# EAGLE design brobot (EAGLE 6.6.0)
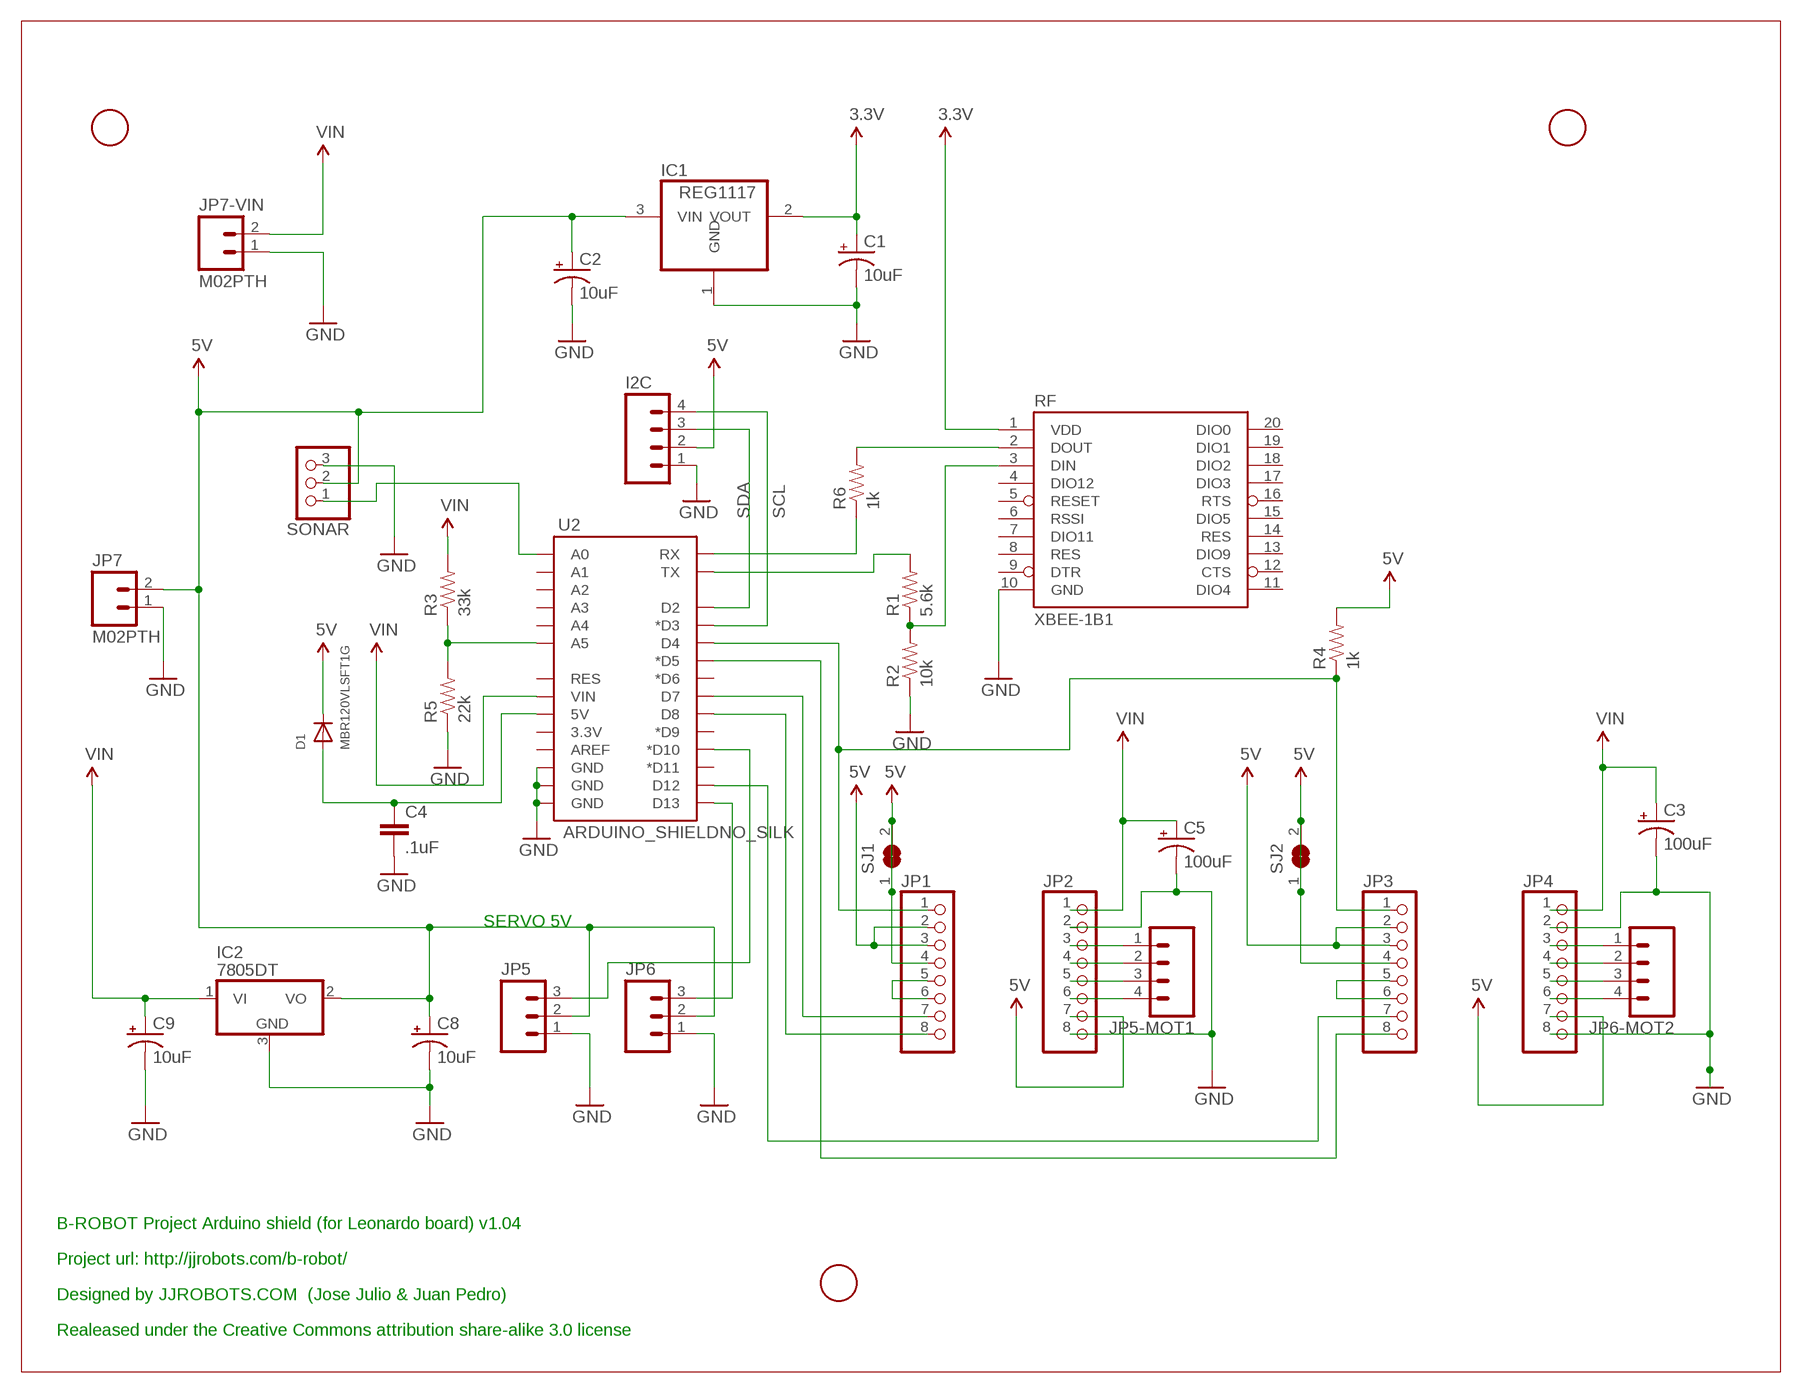
[diagram p0: schematic, sheet 1]

## Parts
C1  10uF  CAP_POL1206  [EIA3216]
C2  10uF  CAP_POL1206  [EIA3216]
C3  100uF  CAP_POLD  [PANASONIC_D]
C4  .1uF  CAP0402-CAP  [0402-CAP]
C5  100uF  CAP_POLD  [PANASONIC_D]
C8  10uF  CAP_POL1206  [EIA3216]
C9  10uF  CAP_POL1206  [EIA3216]
D1  MBR120VLSFT1G  DIODESOD-123  [SOD-123]
I2C  M04PTH  [1X04]
IC1  REG1117  [SOT223]
IC2  7805DT  [TO252]
JP1  PINHD-1X8  [1X08]
JP2  PINHD-1X8  [1X08]
JP3  PINHD-1X8  [1X08]
JP4  PINHD-1X8  [1X08]
JP5  M03PTH  [1X03]
JP5-MOT1  M04PTH  [1X04]
JP6  M03PTH  [1X03]
JP6-MOT2  M04PTH  [1X04]
JP7  M02PTH  [1X02]
JP7-VIN  M02PTH  [1X02]
R1  5.6k  RESISTOR0805-RES  [0805]
R2  10k  RESISTOR0805-RES  [0805]
R3  33k  RESISTOR0805-RES  [0805]
R4  1k  RESISTOR0805-RES  [0805]
R5  22k  RESISTOR0805-RES  [0805]
R6  1k  RESISTOR0805-RES  [0805]
RF  XBEE-1B1  [XBEE-1]
SJ1  SJW  [SJW]
SJ2  SJW  [SJW]
SONAR  PINHD-1X3  [1X03]
U2  ARDUINO_SHIELDNO_SILK  [DUEMILANOVE_VIAS]
U$1  FIDUCIAL  [FIDUCIAL_1MM]
U$2  FIDUCIAL  [FIDUCIAL_1MM]
U$3  FIDUCIAL  [FIDUCIAL_1MM]

## Nets
3.3V: C1.A(+) IC1.2(VOUT) RF.1(VDD)
5V: C2.A(+) C8.A(+) D1.C I2C.2 IC1.3(VIN) IC2.2(VO) JP1.2 JP1.3 JP1.4 JP2.7 JP3.2 JP3.3 JP3.4 JP4.7 JP5.2 JP6.2 JP7.2 R4.2 SJ1.1 SJ1.2 SJ2.1 SJ2.2 SONAR.2
GND: C1.C(-) C2.C(-) C3.- C4.2 C5.- C8.C(-) C9.C(-) I2C.1 IC1.1(GND) IC2.3(GND) JP2.2 JP2.8 JP4.2 JP4.8 JP5.1 JP6.1 JP7-VIN.1 JP7.1 R2.1 R5.1 RF.10(GND) SONAR.3 U2.GND@0(GND) U2.GND@1(GND) U2.GND@2(GND)
N$1: JP2.3 JP5-MOT1.1
N$2: JP2.4 JP5-MOT1.2
N$3: R6.2 RF.2(DOUT)
N$4: R1.1 R2.2 RF.3(DIN)
N$5: R1.2 U2.TX
N$6: JP2.5 JP5-MOT1.3
N$7: JP2.6 JP5-MOT1.4
N$8: JP4.3 JP6-MOT2.1
N$9: JP4.4 JP6-MOT2.2
N$10: JP4.5 JP6-MOT2.3
N$11: JP1.5 JP1.6
N$12: JP3.5 JP3.6
N$13: R3.1 R5.2 U2.A5
N$14: R6.1 U2.RX
N$15: SONAR.1 U2.A0
N$16: JP4.6 JP6-MOT2.4
N$17: JP6.3 U2.D13
N$19: JP5.3 U2.D10(*D10)
N$21: JP1.8 U2.D8
N$22: JP1.7 U2.D7
N$23: JP1.1 JP3.1 R4.1 U2.D4
N$24: JP3.8 U2.D5(*D5)
N$25: JP3.7 U2.D12
N$26: C4.1 D1.A U2.5V
SCL: I2C.4 U2.D3(*D3)
SDA: I2C.3 U2.D2
VIN: C3.+ C5.+ C9.A(+) IC2.1(VI) JP2.1 JP4.1 JP7-VIN.2 R3.2 U2.VIN
Unconnected: RF.4(DIO12) RF.5(RESET) RF.6(RSSI) RF.7(DIO11) RF.8(RES) RF.9(DTR) RF.11(DIO4) RF.12(CTS) RF.13(DIO9) RF.14(RES) RF.15(DIO5) RF.16(RTS) RF.17(DIO3) RF.18(DIO2) RF.19(DIO1) RF.20(DIO0) U2.3.3V U2.A1 U2.A2 U2.A3 U2.A4 U2.AREF U2.D6(*D6) U2.D9(*D9) U2.D11(*D11) U2.RES

## Notes on the sheet
- SERVO 5V
- B-ROBOT Project Arduino shield (for Leonardo board) v1.04
- Project url: http://jjrobots.com/b-robot/
- Designed by JJROBOTS.COM  (Jose Julio & Juan Pedro)
- Realeased under the Creative Commons attribution share-alike 3.0 license

## Library data of the parts
C1-C3 C5 C8 C9 = SparkFun-Passives:CAP_POL: Capacitor Polarized These are standard SMD and PTH capacitors. Normally 10uF, 47uF, and 100uF in electrolytic and tantalum varieties. Always verify the external diameter of the through hole cap, it varies with capacity, voltage, and manufacturer. The EIA devices should be standard.
C4 = SparkFun-Passives:CAP: Capacitor Standard 0603 ceramic capacitor, and 0.1" leaded capacitor.
D1 = adafruit:DIODE: Diode SMADIODE - SMA Surface Mount Package 20V 1A Schottky Diode Digikey: 641-1014-6-ND DO-1N4148 - Through Hole Small Current Diode SOD-123 20V 1 A (.5mV Vf) Schottky Diode - Digikey: MBRX120TPMSCT-ND SOD-323 10V 570mA (.38mV Vf, 3ns) Schottky Diode - Digikey: ZLLS410CT-ND SOD-523 30V 30mA Schottky Diode (RB751S-40TE61) - Digikey: RB751S-40TE61CT-ND SOT23-R/W - SOT23 Package (R = Solder Paste/Reflow Ovens, W = Hand-Soldering) BAT54Film 40V 300mA - Digikey: 497-7162-1-ND
I2C JP5-MOT1 JP6-MOT2 = SparkFun-Connectors:M04: Header 4 Standard 4-pin 0.1" header. Use with straight break away headers (SKU : PRT-00116), right angle break away headers (PRT-00553), swiss pins (PRT-00743), machine pins (PRT-00117), and female headers (PRT-00115). Molex polarized connector foot print use with SKU : PRT-08231 with associated crimp pins and housings. 1MM SMD Version SKU: PRT-10208
IC1 = burr-brown:REG1117: 800mA and 1A Low Dropout (LDO) Positive Regulator 1.8V, 2.5V, 2.85V, 3.3V, 5V, and Adj; MPN: REG1117; OC_FARNELL: 1097566; OC_NEWARK: 14P6981
IC2 = linear:78*: Positive VOLTAGE REGULATOR Source: http://cache.national.com/ds/LM/LM78L05.pdf http://www.fairchildsemi.com/ds/LM/LM7805.pdf
JP1-JP4 = pinhead:PINHD-1X8: PIN HEADER
JP5 JP6 = SparkFun-Connectors:M03: Header 3 Standard 3-pin 0.1" header. Use with straight break away headers (SKU : PRT-00116), right angle break away headers (PRT-00553), swiss pins (PRT-00743), machine pins (PRT-00117), and female headers (PRT-00115). Molex polarized connector foot print use with SKU : PRT-08232 with associated crimp pins and housings.
JP7 JP7-VIN = SparkFun-Connectors:M02: Standard 2-pin 0.1" header. Use with - straight break away headers ( PRT-00116) - right angle break away headers (PRT-00553) - swiss pins (PRT-00743) - machine pins (PRT-00117) - female headers (PRT-00115) Molex polarized connector foot print use with: PRT-08233 with associated crimp pins and housings. 2.54_SCREWTERM for use with PRT-10571. 3.5mm Screw Terminal footprints for PRT-08084 5mm Screw Terminal footprints for use with PRT-08433
R1-R6 = SparkFun-Resistors:RESISTOR: Resistor Basic schematic elements and footprints for 0603, 1206, and PTH resistors.
RF = SparkFun-RF:XBEE-1: Xbee module footprints SMT header is CONN-09042.
SJ1 SJ2 = jumper:SJ: SMD solder JUMPER
SONAR = adafruit:PINHD-1X3: PIN HEADER
U2 = SparkFun-Boards:ARDUINO_SHIELD: Arduino shield footprint
U$1-U$3 = adafruit:FIDUCIAL: For use by pick and place machines to calibrate the vision/machine, 1mm By microbuilder.eu

## Board
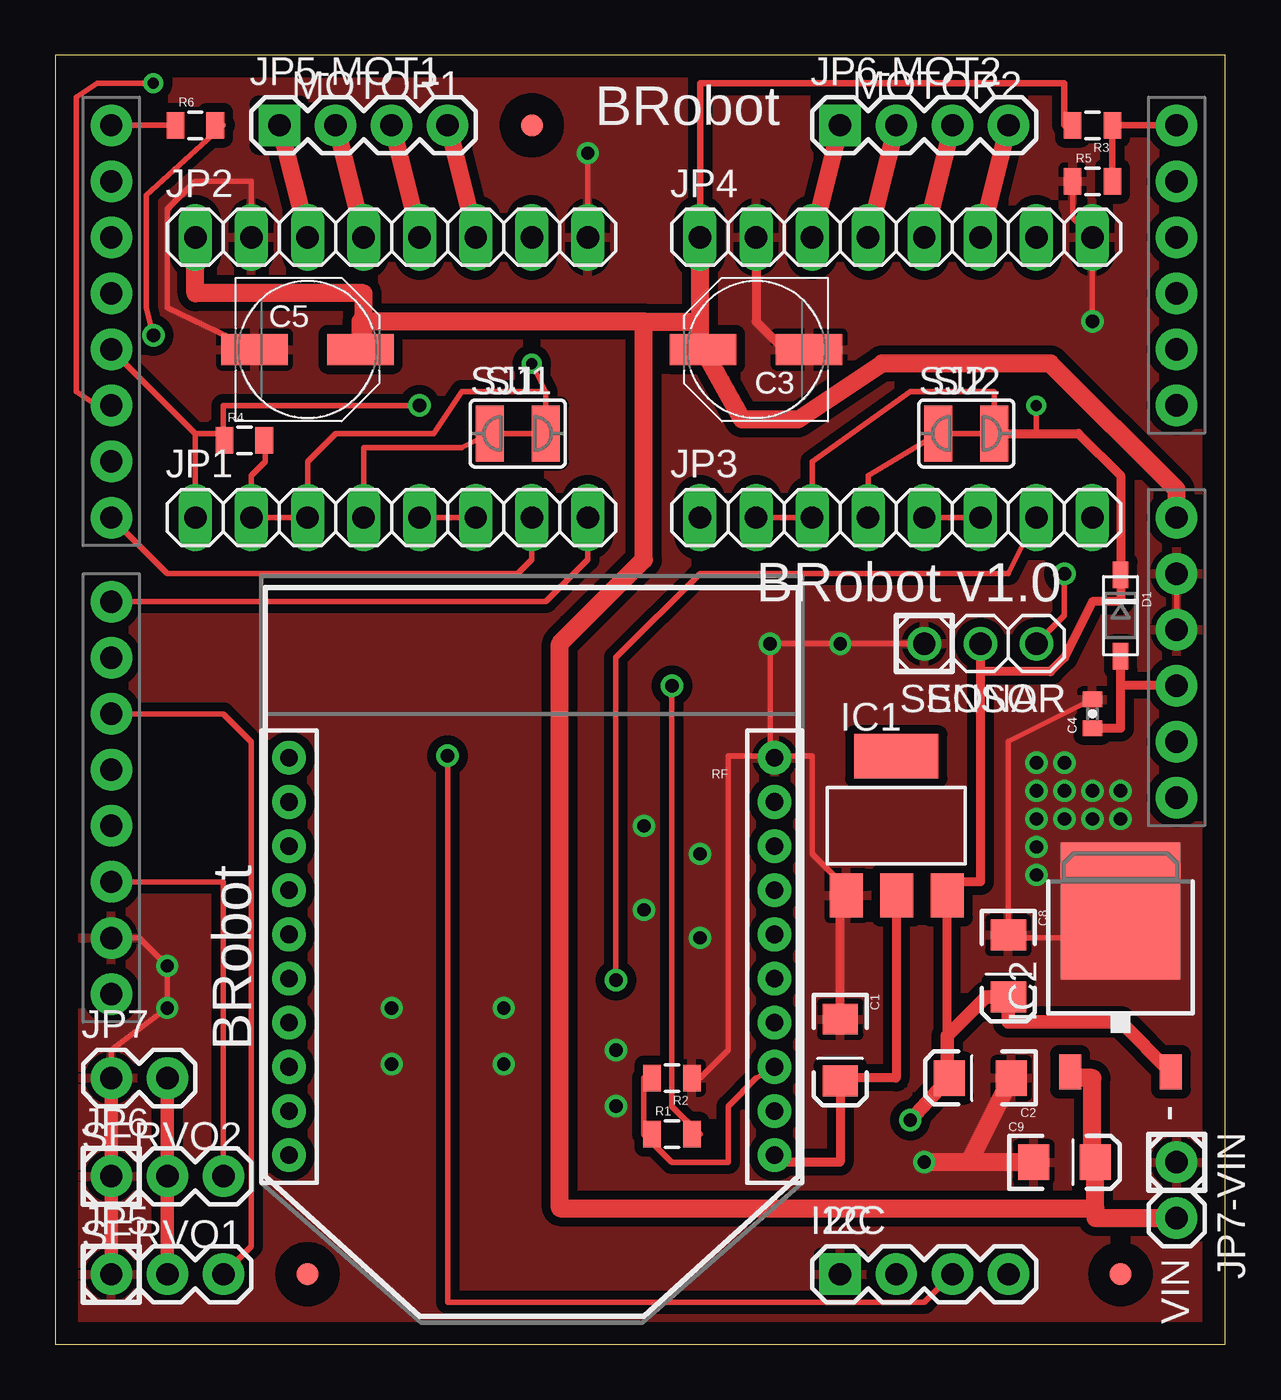
[diagram p1: board, top side]
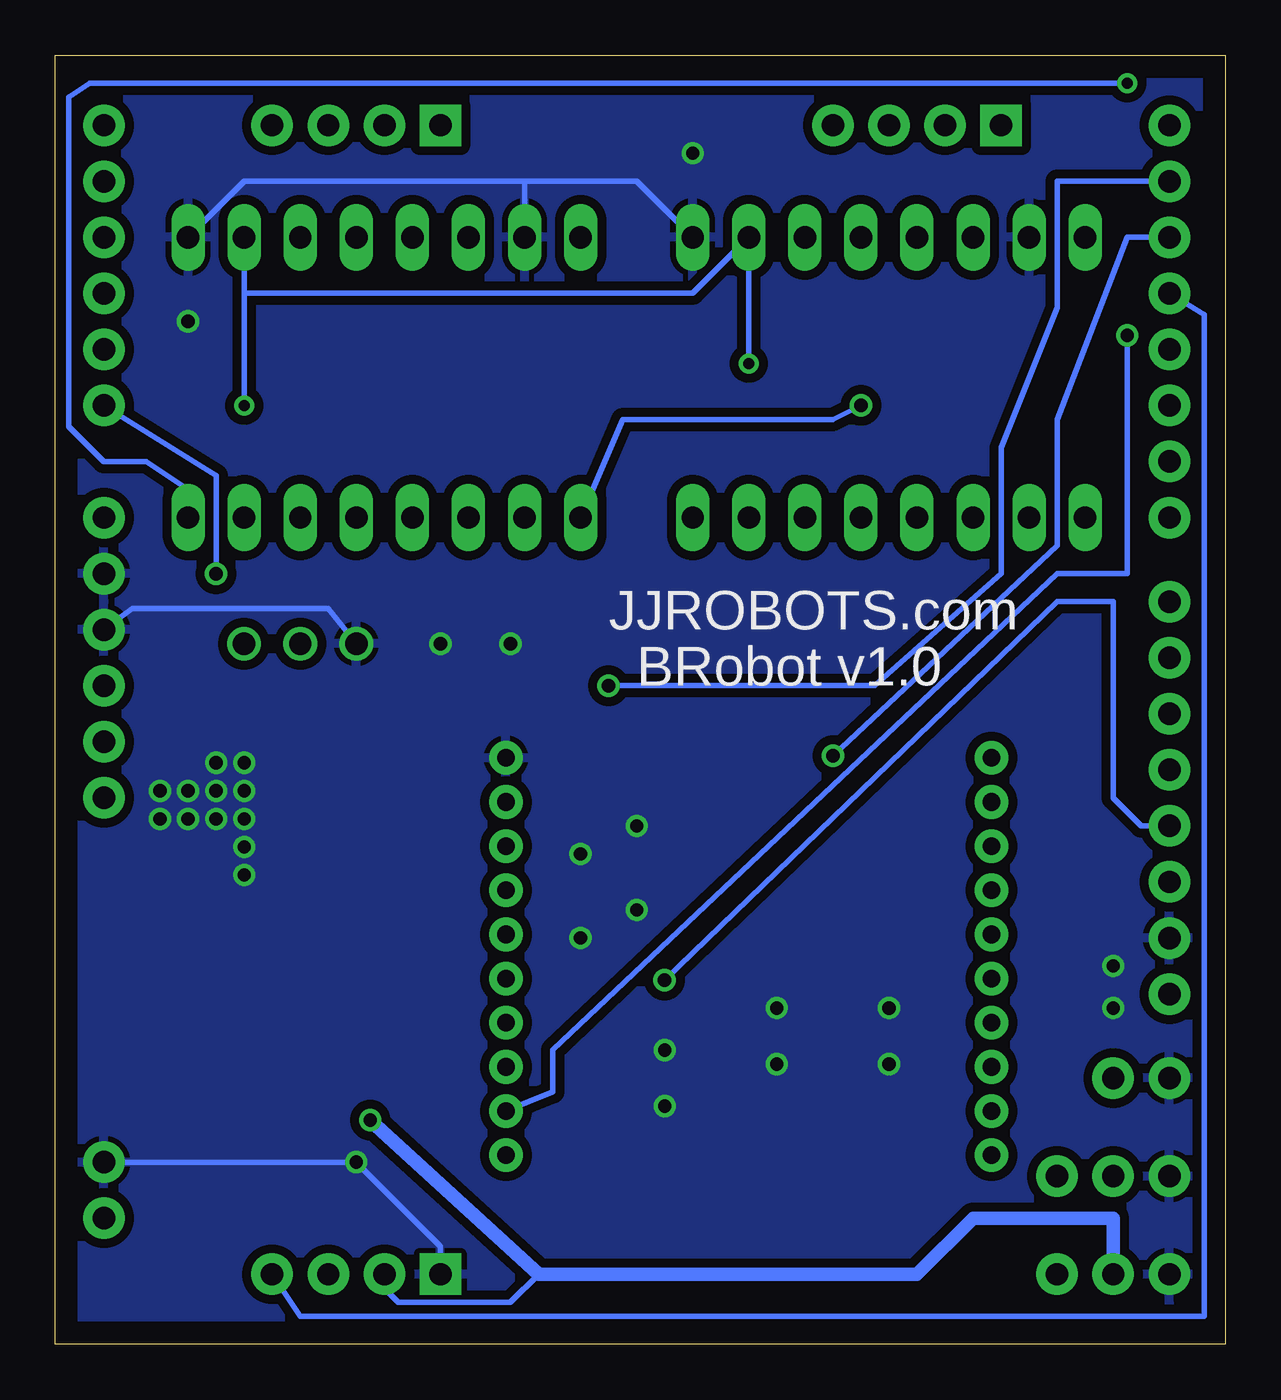
[diagram p2: board, bottom side, seen from below]

Size 53.01 x 58.42 mm. Coordinates in mm from the lower left corner, seen from the top.
Outline: 0,0 53.01,0 53.01,58.41 27.94,58.42 12.7,58.42 12.07,58.41 0,58.41 0,0
Copper layers (1*16): Top 0.035mm / dielectric 1.5mm / Bottom 0.035mm
Design rules "default": minimum track width 10mil, minimum drill 24mil, track to track 8mil, track to pad 8mil, pad to pad 8mil, via to via 8mil, smd to smd 8mil, copper to edge 40mil, drill to drill 8mil, minimum pad ring 10mil, minimum via ring 8mil, stop-mask expansion 4mil, vias tented up to drill 0mil, thermal gap 10mil

### Footprints (pad centres in the part's own frame; a part is rotated, then mirrored left to right if it is on the bottom)
EIA3216 = smd 1.4 x 1.6: A 1.4,0; C -1.4,0
PANASONIC_D = smd 3 x 1.4: + 2.4,0; - -2.4,0
0402-CAP = smd 0.7 x 0.9: 1 -0.65,0; 2 0.65,0
SOD-123 = smd 1.2 x 0.7: A 1.85,0; C -1.85,0
1X04 = drill 1.016 pad 1.88 square: 1 0,0 | drill 1.016 pad 1.88: 2 2.54,0; 3 5.08,0; 4 7.62,0
SOT223 = smd 1.499 x 2.007: 1 -2.261,-3.15; 2 0.025,-3.15; 3 2.311,-3.15 | smd 3.81 x 2.007: 4 0,3.15
TO252 = smd 1 x 1.6: 1 -2.28,-4.8; 2 2.28,-4.8 | smd 5.4 x 6.2: 3 0,2.5
1X08 = drill 1.016 long: 1 -8.89,0; 2 -6.35,0; 3 -3.81,0; 4 -1.27,0; 5 1.27,0; 6 3.81,0; 7 6.35,0; 8 8.89,0
1X03 = drill 1.016 pad 1.88: 1 0,0; 2 2.54,0; 3 5.08,0
1X02 = drill 1.016 pad 1.88: 1 0,0; 2 2.54,0
0805 = smd 0.8 x 1.2: 1 -0.9,0; 2 0.9,0
XBEE-1 = drill 0.8 pad 1.524: 1 -11,20; 2 -11,18; 3 -11,16; 4 -11,14; 5 -11,12; 6 -11,10; 7 -11,8; 8 -11,6; 9 -11,4; 10 -11,2; 11 11,2; 12 11,4; 13 11,6; 14 11,8; 15 11,10; 16 11,12; 17 11,14; 18 11,16; 19 11,18; 20 11,20
SJW = smd 1.27 x 2.54: 1 -1.27,0; 2 1.27,0
1X03' = drill 1.016: 1 -2.54,0; 2 0,0; 3 2.54,0
DUEMILANOVE_VIAS = drill 1.016 pad 1.88: 3.3V 50.8,13.97; 5V 50.8,16.51; A0 50.8,29.21; A1 50.8,31.75; A2 50.8,34.29; A3 50.8,36.83; A4 50.8,39.37; A5 50.8,41.91; AREF 2.54,2.54; D2 2.54,36.83; D3 2.54,34.29; D4 2.54,31.75; D5 2.54,29.21; D6 2.54,26.67; D7 2.54,24.13; D8 2.54,20.32; D9 2.54,17.78; D10 2.54,15.24; D11 2.54,12.7; D12 2.54,10.16; D13 2.54,7.62; GND@0 50.8,19.05; GND@1 50.8,21.59; GND@2 2.54,5.08; RES 50.8,11.43; RX 2.54,41.91; TX 2.54,39.37; VIN 50.8,24.13
FIDUCIAL_1MM = smd 1 x 1: 1 0,0

### Placement (x,y rotation side)
C1  35.56,13.34 270 top
C2  41.91,12.07 180 top
C3  31.75,45.09 180 top
C4  46.99,28.58 90 top
C5  11.43,45.09 0 top
C8  43.18,17.15 270 top
C9  45.72,8.25 0 top
D1  48.26,33.02 270 top
I2C  35.56,3.18 0 top
IC1  38.1,23.49 0 top
IC2  48.26,17.15 0 top
JP1  15.24,37.47 0 top
JP2  15.24,50.17 0 top
JP3  38.1,37.47 0 top
JP4  38.1,50.17 0 top
JP5  2.54,3.18 0 top
JP5-MOT1  10.16,55.25 0 top
JP6  2.54,7.62 0 top
JP6-MOT2  35.56,55.25 0 top
JP7  2.54,12.07 0 top
JP7-VIN  50.8,8.25 270 top
R1  27.94,9.52 0 top
R2  27.94,12.07 180 top
R3  46.99,55.25 180 top
R4  8.57,40.96 0 top
R5  46.99,52.7 0 top
R6  6.35,55.25 0 top
RF  21.59,28.58 180 top
SJ1  20.96,41.27 0 top
SJ2  41.28,41.27 0 top
SONAR  [1X03']  41.91,31.75 180 top
U2  0,13.34 0 top
U$1  11.43,3.18 0 top
U$2  21.59,55.25 0 top
U$3  48.26,3.18 0 top

### Tracks (layer width: path | path; a pad name or v marks a point on that pad's centre or on a via)
3.3V
  Top 0.406: IC1.2 38.1,20.34 38.1,12.07 35.56,12.07 C1.A 35.56,8.25 32.59,8.25 RF.1
5V  (via drill 0.5, 0.6)
  Top 0.254: R4.2 9.53,41.01 9.53,40.01 8.89,39.37 JP1.2 JP1.3 11.43,40.01 12.7,41.27 17.14,41.27 18.42,43.18 22.22,43.18 | JP3.2 JP3.3 34.29,40.01 38.73,43.18 42.55,43.18 SJ2.2 SJ2.1 36.83,39.37 JP3.4 | 22.22,43.18 SJ1.2 SJ1.1 18.42,40.64 13.97,40.64 JP1.4 | 22.22,43.18 v21.59,44.45 | 44.45,41.27 v44.45,42.55
  Top 0.406: SJ2.2 44.45,41.27 46.36,41.27 48.26,39.37 D1.C 48.26,33.66 46.99,33.66 45.72,31.12 45.09,30.48 41.91,30.48 | SONAR.2 41.91,30.48 | 41.91,30.48 41.91,20.95 40.41,20.95 IC1.3 40.41,13.97 | C2.A 40.41,12.07
  Top 0.61: 40.41,12.07 40.41,13.97 42.19,15.75 C8.A 43.18,14.61 48.26,14.61 50.52,12.34 IC2.2 | v38.73,10.16 C2.A | JP5.2 JP6.2 JP7.2
  Bottom 0.254: 44.45,47.62 24.13,47.62 JP2.7 v21.59,44.45 | JP4.7 44.45,47.62 | 44.45,47.62 v44.45,42.55 | I2C.2 38.1,2.54 37.47,1.91 32.39,1.91 31.11,3.18
  Bottom 0.61: v38.73,10.16 31.11,3.18 13.97,3.18 11.43,5.71 5.08,5.71 JP5.2
GND  (via drill 0.6)
  Top 0.254: 32.39,26.67 30.48,26.67 30.48,13.34 29.21,12.07 R2.1 | 32.39,26.67 34.29,26.67 34.29,22.23 35.56,20.95 IC1.1 | SONAR.3 v35.56,31.75 v32.39,31.75 32.39,26.67 | 32.39,26.67 RF.10 | C4.2 43.18,27.32 C8.C 43.18,18.41 48.26,18.41 IC2.3 | C5.- 5.08,46.99 5.08,51.44 6.35,52.7 8.89,52.7 JP2.2 | 33.02,45.09 C3.- | U2.GND@2 3.81,18.41 v5.08,17.15 v5.08,15.24 2.54,13.34 JP7.1 | R5.1 46.09,51.06 JP4.8 v46.99,46.35 | v24.13,53.97 JP2.8 | U2.GND@0 U2.GND@1
  Top 0.406: C1.C 35.56,19.69 35.84,19.69 IC1.1 | 33.02,45.09 31.75,46.35 JP4.2
  Top 0.61: JP5.1 JP6.1 JP7.1
  Top 0.813: C9.C 41.41,8.25 | 41.41,8.25 C2.C | 41.41,8.25 v39.37,8.25
  Bottom 0.254: JP4.8 44.45,52.7 31.75,52.7 | JP4.2 31.75,52.7 | JP7-VIN.1 v39.37,8.25 35.56,4.45 I2C.1 | JP2.8 26.67,52.7 31.75,52.7 | U2.GND@0 49.53,33.34 40.64,33.34 SONAR.3
  other vias: 44.45,26.35 44.45,25.08 26.67,23.49 29.21,22.23 26.67,19.69 29.21,18.41 44.45,23.81 45.72,25.08 45.72,23.81 46.99,25.08 46.99,23.81 48.26,25.08 48.26,23.81 25.4,13.34 25.4,10.8 20.32,15.24 20.32,12.7 15.24,15.24 15.24,12.7 45.72,26.35 44.45,22.54 44.45,21.27
  pour Top (isolate 0.406): 0,58.42 53.34,58.42 53.34,-0.63 0,-0.63
  pour Bottom (isolate 0.406): 0,58.42 53.34,58.42 53.34,0 0,0
  pour Top (no thermals): 45.09,23.18 51.44,23.18 51.44,15.88 45.09,15.88
N$1
  Top 0.813: JP5-MOT1.1 JP2.3
N$2
  Top 0.813: JP5-MOT1.2 JP2.4
N$3  (via drill 0.61)
  Top 0.254: v4.45,45.72 4.13,46.99 4.13,52.07 7.62,55.25 R6.2
  Bottom 0.254: v4.45,45.72 4.45,34.92 7.62,34.92 30.48,13.34 30.48,11.43 RF.2
N$4
  Top 0.254: 26.67,9.52 26.67,12.07 R2.2 | 26.67,9.52 27.94,8.25 30.48,8.25 30.48,10.8 31.75,12.07 32.39,12.38 RF.3 | 26.67,9.52 R1.1
N$5  (via drill 0.61)
  Top 0.254: v27.94,29.84 27.94,10.8 29.21,9.52 R1.2
  Bottom 0.254: v27.94,29.84 15.88,29.84 10.16,34.92 10.16,40.64 7.62,46.99 7.62,52.7 U2.TX
N$6
  Top 0.813: JP5-MOT1.3 JP2.5
N$7
  Top 0.813: JP5-MOT1.4 JP2.6
N$8
  Top 0.813: JP6-MOT2.1 JP4.3
N$9
  Top 0.813: JP6-MOT2.2 JP4.4
N$10
  Top 0.813: JP6-MOT2.3 JP4.5
N$11
  Top 0.254: JP1.6 JP1.5
N$12
  Top 0.254: JP3.6 JP3.5
N$13
  Top 0.305: U2.A5 R3.1 R5.2
N$14
  Top 0.254: U2.RX R6.1
N$15  (via drill 0.61)
  Top 0.254: SONAR.1 45.72,33.02 v45.72,34.92
  Bottom 0.254: v45.72,34.92 45.72,39.37 U2.A0
N$16
  Top 0.813: JP6-MOT2.4 JP4.6
N$17
  Top 0.254: U2.D13 7.62,20.95 JP6.3
N$19
  Top 0.254: U2.D10 7.62,28.58 8.89,27.3 8.89,4.45 JP5.3
N$21
  Top 0.254: JP1.8 24.13,35.56 22.22,33.66 U2.D8
N$22
  Top 0.254: JP1.7 21.59,35.56 20.96,34.92 5.08,34.92 U2.D7
N$23  (via drill 0.61)
  Top 0.254: 6.35,41.27 7.62,41.27 | JP1.1 6.35,41.27 | v16.51,42.55 7.62,42.55 7.62,41.27 | 7.62,41.27 R4.1 | 6.35,41.27 U2.D4
  Bottom 0.254: JP3.1 27.31,41.91 17.78,41.91 v16.51,42.55
N$24  (via drill 0.5)
  Top 0.254: v4.45,57.15 1.91,57.15 0.95,56.52 0.95,43.18 1.91,42.55 U2.D5
  Bottom 0.254: JP3.8 46.99,38.73 48.9,40.01 50.8,40.01 52.39,41.59 52.39,56.52 51.44,57.15 v4.45,57.15
N$25  (via drill 0.61)
  Top 0.254: JP3.7 43.18,34.92 29.21,34.92 25.4,31.12 v25.4,16.51
  Bottom 0.254: v25.4,16.51 7.62,33.66 5.08,33.66 5.08,24.77 3.81,23.49 U2.D12
N$26
  Top 0.406: C4.1 48.26,27.92 48.26,29.84 | 48.26,29.84 D1.A | U2.5V 48.26,29.84
SCL
  Bottom 0.254: I2C.4 41.91,1.27 0.95,1.27 0.95,46.67 U2.D3
SDA  (via drill 0.61)
  Top 0.254: I2C.3 39.37,1.91 17.78,1.91 v17.78,26.67
  Bottom 0.254: v17.78,26.67 7.62,36.2 7.62,41.91 4.45,50.17 U2.D2
VIN
  Top 0.305: R3.2 45.72,55.25 45.72,57.15 29.21,57.15 JP4.1
  Top 0.813: 26.67,46.35 26.67,35.56 22.86,31.75 22.86,6.17 47.12,6.17 | 29.21,46.35 29.21,45.09 C3.+ 31.11,41.91 33.66,41.91 37.47,44.45 45.09,44.45 50.8,38.73 U2.VIN | 29.21,46.35 JP4.1 | 26.67,46.35 29.21,46.35 | 26.67,46.35 13.83,46.35 C5.+ 13.97,45.09 13.97,47.62 6.35,47.62 JP2.1 | 47.12,6.17 C9.A 46.99,8.25 46.99,12.07 45.98,12.07 IC2.1 | JP7-VIN.2 47.12,5.71 47.12,6.17

### Text on the board
tSilk: BRobot | BRobot
_tsilk: BRobot v1.0
_bsilk: JJROBOTS.com | BRobot v1.0
_tNames: MOTOR1 | MOTOR2 | C5 | C3 | SJ1 | SJ2 | SENSOR | C4 | - | SERVO2 | I2C | SERVO1 | VIN